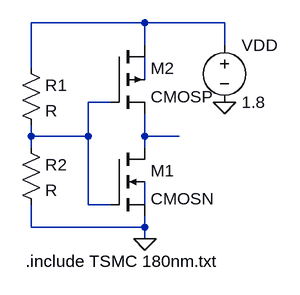
[diagram p0: schematic 4.asc]
4.asc, the LTspice schematic file:
Version 4
SHEET 1 880 680
WIRE 240 -96 80 -96
WIRE 352 -96 240 -96
WIRE 240 -64 240 -96
WIRE 352 -64 352 -96
WIRE 80 -32 80 -96
WIRE 240 -16 240 -48
WIRE 192 16 160 16
WIRE 80 64 80 48
WIRE 160 64 160 16
WIRE 160 64 80 64
WIRE 240 64 240 32
WIRE 288 64 240 64
WIRE 80 80 80 64
WIRE 240 80 240 64
WIRE 160 160 160 64
WIRE 192 160 160 160
WIRE 240 160 240 128
WIRE 80 192 80 160
WIRE 240 192 240 176
WIRE 240 192 80 192
WIRE 240 208 240 192
FLAG 240 208 0
FLAG 352 16 0
SYMBOL nmos4 192 80 R0
SYMATTR InstName M1
SYMATTR Value CMOSN
SYMBOL pmos4 192 -64 R0
SYMATTR InstName M2
SYMATTR Value CMOSP
SYMBOL voltage 352 -80 R0
WINDOW 123 0 0 Left 0
WINDOW 39 0 0 Left 0
SYMATTR InstName VDD
SYMATTR Value 1.8
SYMBOL res 64 -48 R0
SYMATTR InstName R1
SYMBOL res 64 64 R0
SYMATTR InstName R2
TEXT 72 240 Left 2 !.include TSMC 180nm.txt

The netlist it stands for:
* 4.asc
M1 N004 N003 0 N005 CMOSN
M2 N001 N003 N004 N002 CMOSP
VDD N001 0 1.8
R1 N001 N003 R
R2 N003 0 R
.model NMOS NMOS
.model PMOS PMOS
.lib standard.mos
.include TSMC 180nm.txt
.backanno
.end